# EAGLE schematic cavedweller (EAGLE 7.5.0)
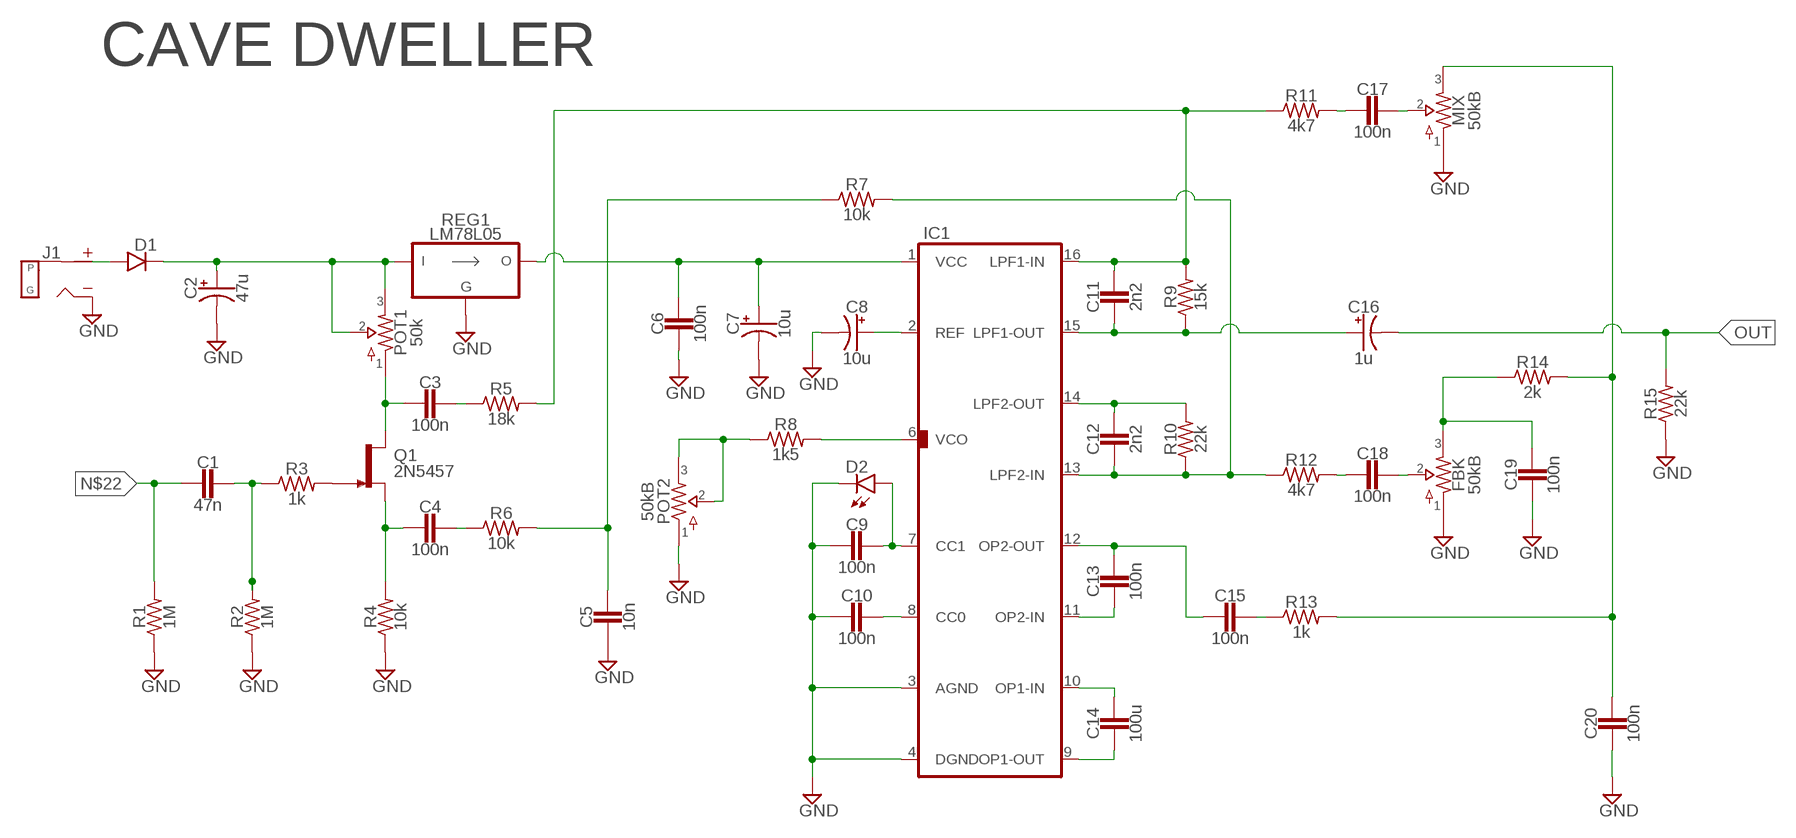
[diagram p0: schematic, sheet 1]

## Parts
C1  47n  CER/FILM2  [050X030_025_2]
C2  47u  0501  [050_020_1]
C3  100n  CER/FILM2  [050X030_025_2]
C4  100n  CER/FILM2  [050X030_025_2]
C5  10n  CER/FILM2  [050X030_025_2]
C6  100n  CER/FILM2  [050X030_025_2]
C7  10u  0501  [050_020_1]
C8  10u  0501  [050_020_1]
C9  100n  CER/FILM2  [050X030_025_2]
C10  100n  CER/FILM2  [050X030_025_2]
C11  2n2  CER/FILM2  [050X030_025_2]
C12  2n2  CER/FILM2  [050X030_025_2]
C13  100n  CER/FILM2  [050X030_025_2]
C14  100u  CER/FILM2  [050X030_025_2]
C15  100n  CER/FILM2  [050X030_025_2]
C16  1u  0501  [050_020_1]
C17  100n  CER/FILM2  [050X030_025_2]
C18  100n  CER/FILM2  [050X030_025_2]
C19  100n  CER/FILM2  [050X030_025_2]
C20  100n  CER/FILM2  [050X030_025_2]
D1  DO41.3  [DO41-3]
D2  LEDB  [3MM_B]
FBK  50kB  POTSSMALL_PADS  [PADS_SMALL]
IC1  PT2399TH  [DIL16]
J1  DC_MONO  [DC]
MIX  50kB  POTSSMALL_PADS  [PADS_SMALL]
POT1  50k  POTSTRIM  [2262_TRIM]
POT2  50kB  POTSSMALL_PADS  [PADS_SMALL]
Q1  2N5457  [TO92-]
R1  1M  R_.2  [R0207/2V]
R2  1M  R_.2  [R0207/2V]
R3  1k  R_.2  [R0207/2V]
R4  10k  R_.2  [R0207/2V]
R5  18k  R_.2  [R0207/2V]
R6  10k  R_.2  [R0207/2V]
R7  10k  R_.2  [R0207/2V]
R8  1k5  R_.2  [R0207/2V]
R9  15k  R_.2  [R0207/2V]
R10  22k  R_.2  [R0207/2V]
R11  4k7  R_.2  [R0207/2V]
R12  4k7  R_.2  [R0207/2V]
R13  1k  R_.2  [R0207/2V]
R14  2k  R_.2  [R0207/2V]
R15  22k  R_.2  [R0207/2V]
REG1  LM78L05  [TO92-]

## Nets
GND: C2.- C5.2 C6.2 C7.- C8.- C9.2 C10.2 C19.2 C20.2 D2.K(C) FBK.1 IC1.3(AGND) IC1.4(DGND) J1.S(SLEEVE) MIX.1 POT2.1 R1.1 R2.1 R4.1 R15.1 REG1.2(GND)
IN: C1.1 R2.2 R3.1
N$1: D1.A J1.T(TIP)
N$2: C2.+ D1.C POT1.2 POT1.3 REG1.1(VI)
N$3: C3.2 POT1.1 Q1.3(D)
N$4: C4.2 Q1.2(S) R4.2
N$5: Q1.1(G) R3.2
N$6: C9.1 D2.A IC1.7(CC1)
N$7: C10.1 IC1.8(CC0)
N$8: C12.1 IC1.14(LPF2-OUT) R10.2
N$9: C12.2 IC1.13(LPF2-IN) R7.2 R10.1 R12.1
N$10: C6.1 C7.+ IC1.1(VCC) REG1.3(VO)
N$11: C17.2 R11.2
N$12: C14.1 IC1.10(OP1-IN)
N$13: C14.2 IC1.9(OP1-OUT)
N$14: C13.2 IC1.11(OP2-IN)
N$15: C13.1 C15.2 IC1.12(OP2-OUT)
N$17: C17.1 MIX.2
N$18: C11.1 IC1.16(LPF1-IN) R5.2 R9.2 R11.1
N$19: C18.2 R12.2
N$20: C8.+ IC1.2(REF)
N$21: C18.1 FBK.2
N$22: C1.2 R1.2
N$23: C19.1 FBK.3 R14.1
N$24: C11.2 C16.+ IC1.15(LPF1-OUT) R9.1
N$25: C15.1 R13.1
N$26: POT2.2 POT2.3 R8.1
N$29: C3.1 R5.1
N$30: C20.1 MIX.3 R13.2 R14.2
N$31: C4.1 R6.1
N$32: C5.1 R6.2 R7.1
N$33: IC1.6(VCO) R8.2
OUT: C16.- R15.2

## Notes on the sheet
- CAVE DWELLER

## Library data of the parts
C1 C3-C6 C9-C15 C17-C20 = capacitors-film:CER/FILM: 47 - 120pF Xicon Ceramic Disc 2.5mm lead spacing
C2 C7 C8 C16 = capacitors-elec:050: 0.22 - 100uF Xicon values at Mouser.com: 10V: 10 - 100uF; 16V: 2.2 - 47uF; 25V: 0.47 - 47uF; 50V: 0.22 - 22uF
D1 = diodes:DO41: DO-41 Package Diodes: 1N4001 - 1N40019 Zener Diodes: 1N4728 - 1N4764
D2 = diodes:LED
FBK MIX POT1 POT2 = potentiometers:POTS
IC1 = integrated circuits:PT2399: Echo Processor IC
J1 = jacks:DC_MONO
Q1 = transistors:2N5457: N-CHANNEL JFET
R1-R15 = resistors:R_
REG1 = regulators:LM78L05